# EAGLE schematic YAAB (EAGLE 6.4)
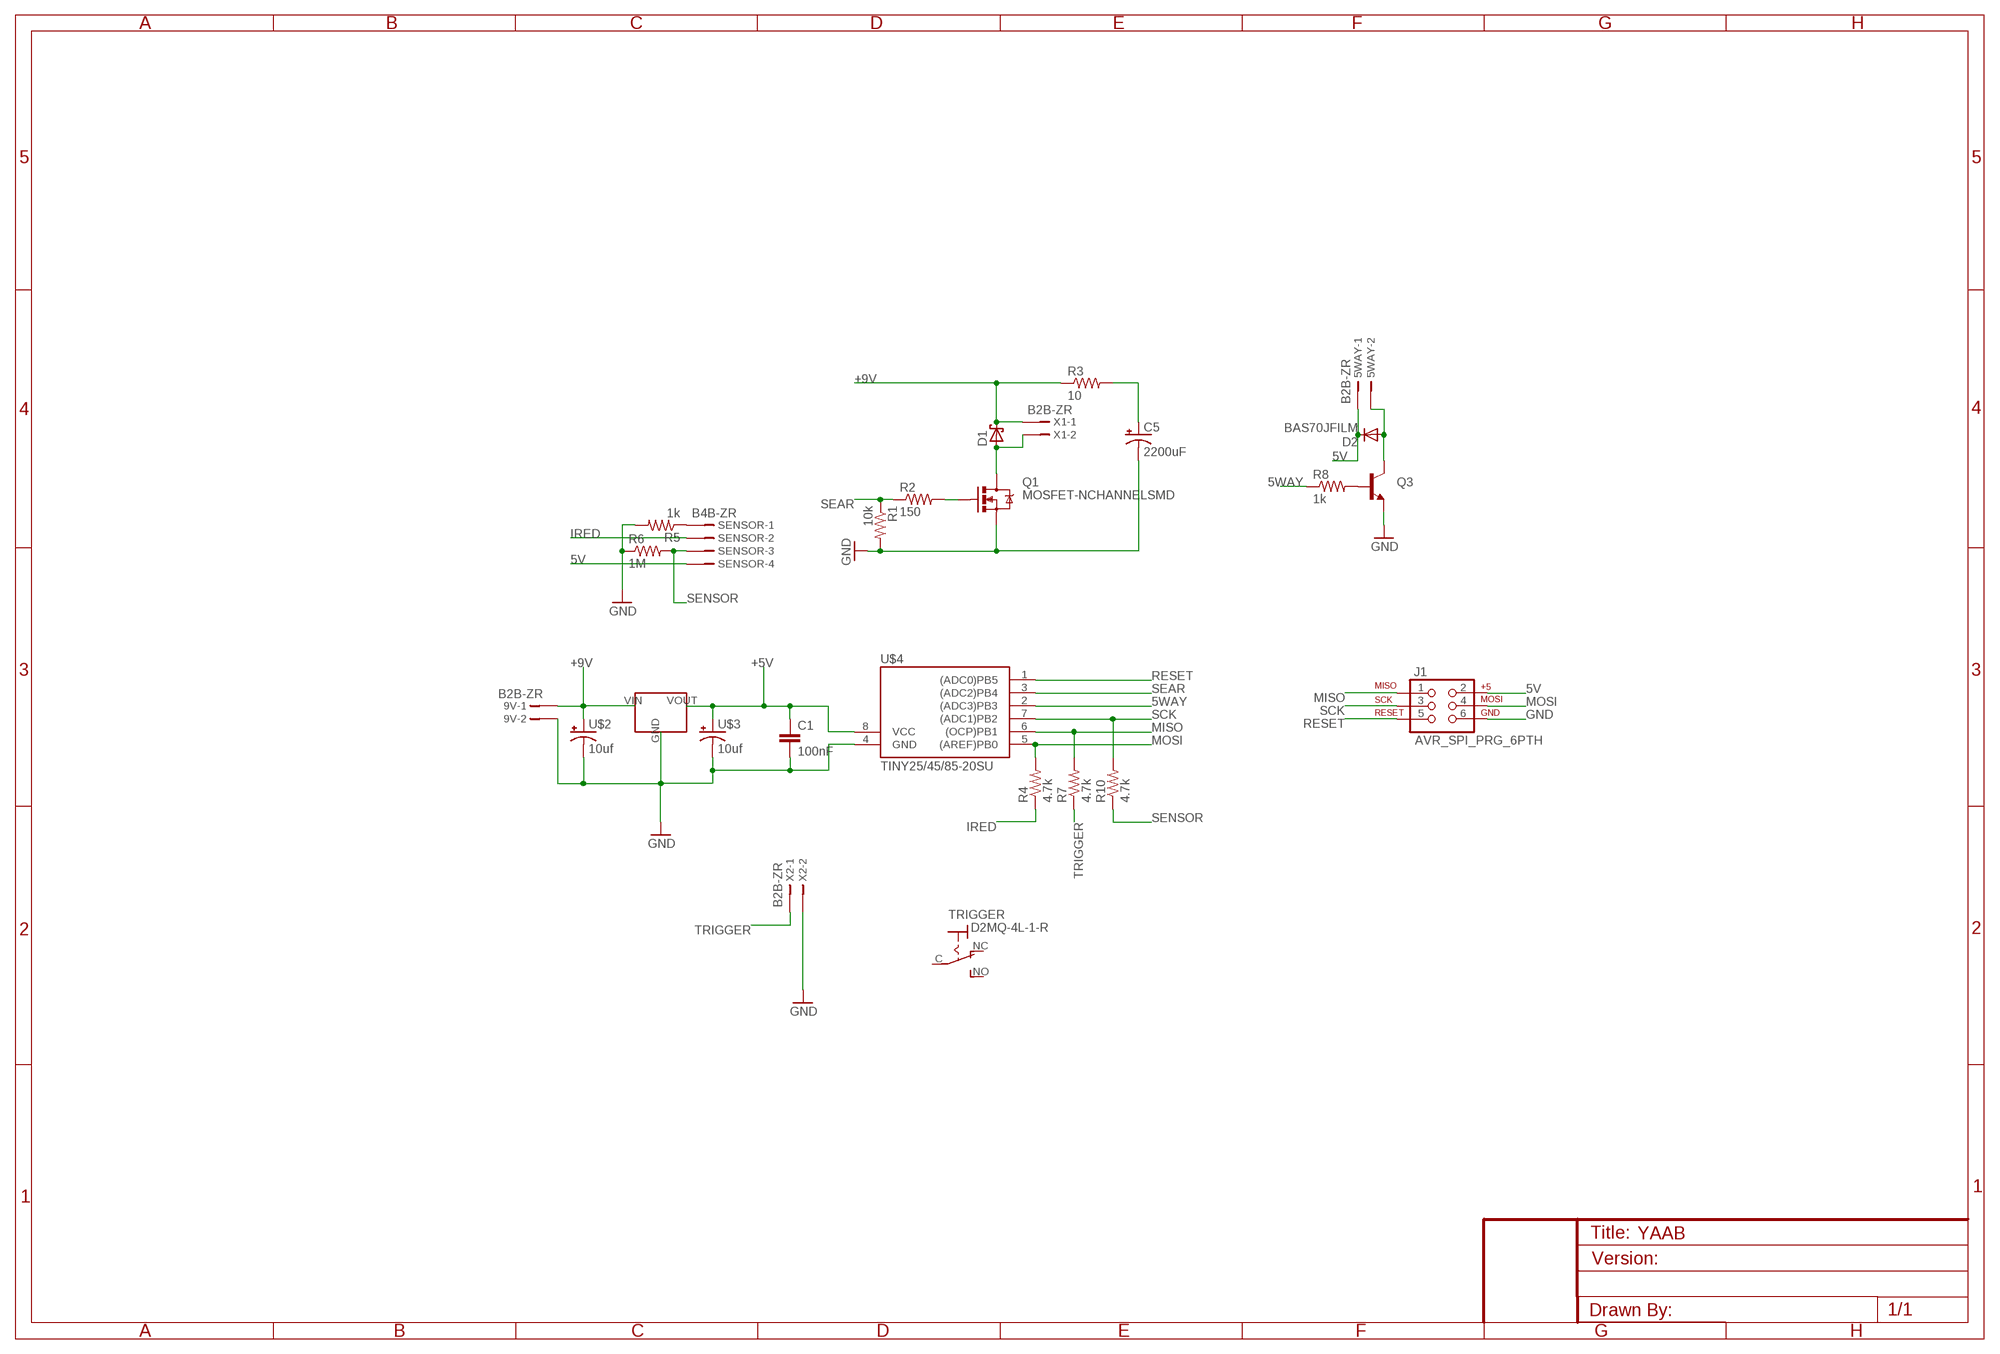
[diagram p0: schematic, sheet 1]

## Parts
5WAY  B2B-ZR  [B2B-ZR@1]
9V  B2B-ZR  [B2B-ZR@1]
C1  100nF  CAPKIT  [CAP-PTH-SMALL-KIT]
C5  2200uF  AVESMB  [AVES***M**B]
D1  SCHOTTKY-DIODESMC  [SMC]
D2  BAS70JFILM  DIODESOD  [SOD-323]
J1  AVR_SPI_PRG_6PTH  [2X3]
Q1  MOSFET-NCHANNELSMD  [SOT23-3]
Q3  TRANSISTOR_NPNSOT89  [SOT89]
R1  10k  RESISTOR0603-RES  [0603-RES]
R2  150  RESISTOR0603-RES  [0603-RES]
R3  10  RESISTOR0603-RES  [0603-RES]
R4  4.7k  RESISTOR1206  [1206]
R5  1k  R-US_R0603  [R0603]
R6  1M  R-US_R0603  [R0603]
R7  4.7k  RESISTOR1206  [1206]
R8  1k  R-US_R0603  [R0603]
R10  4.7k  RESISTOR1206  [1206]
SENSOR  B4B-ZR  [B4B-ZR]
TRIGGER  D2MQ-4L-1-R  [D2MQ-4L-1-R]
U$1  L78M05C  [SOT-89]
U$2  10uf  AVESMB  [AVES***M**B]
U$3  10uf  AVESMB  [AVES***M**B]
U$4  TINY25/45/85-20SU  [SOIC8]
X1  B2B-ZR  [B2B-ZR@1]
X2  B2B-ZR  [B2B-ZR]

## Nets
5V: 5WAY.1 D2.1(C) J1.2 SENSOR.4
5WAY: R8.1 U$4.2((ADC3)PB3)
+5V: C1.1 U$1.VOUT(OUT) U$3.P$1+(+) U$4.8(VCC)
+9V: 9V.1 D1.C R3.1 U$1.VIN(IN) U$2.P$1+(+) X1.1
GND: 9V.2 C1.2 C5.P$2-(-) J1.6 Q1.2(S) Q3.3(E) R1.2 R5.2 R6.1 U$1.GND U$2.P$2-(-) U$3.P$2-(-) U$4.4(GND)
IRED: R4.1 SENSOR.2
MISO: J1.1 R7.2 U$4.6((OCP)PB1)
MOSI: J1.4 R4.2 U$4.5((AREF)PB0)
N$2: Q1.1(G) R2.2
N$3: D1.A Q1.3(D) X1.2
N$4: C5.P$1+(+) R3.2
N$9: R5.1 SENSOR.1
N$15: 5WAY.2 D2.2(A) Q3.2(C)
N$17: Q3.1(B) R8.2
RESET: J1.5 U$4.1((ADC0)PB5)
SCK: J1.3 R10.2 U$4.7((ADC1)PB2)
SEAR: R1.1 R2.1 U$4.3((ADC2)PB4)
SENSOR: R6.2 R10.1 SENSOR.3
TRIGGER: R7.1 X2.1 X2.2
Unconnected: TRIGGER.C(P) TRIGGER.NC(O) TRIGGER.NO(S)

## Library data of the parts
5WAY 9V X1 = Parts:B2B-ZR: ZH CONNECTOR 1.5 mm, 2 pin 1 row Source: http://www.jst.com .. eZH.pdf
C1 = SparkFun:CAP: Capacitor Standard 0603 ceramic capacitor, and 0.1" leaded capacitor.
C5 U$2 U$3 = Parts:AVES***M**B
D1 = diode:SCHOTTKY-DIODE: Schottky Diode
D2 = SparkFun:DIODE: Diode These are standard reverse protection diodes and small signal diodes. SMA package can handle up to about 1A. SOD-323 can handle about 200mA. What the SOD-323 package when ordering, there are some mfgs out there that are 5-pin packages.
J1 = SparkFun:AVR_SPI_PRG_6: AVR ISP 6 Pin This is the reduced ISP connector for AVR programming. Common on Arduino. This footprint will take up less PCB space and can be used with a 10-pin to 6-pin adapter such as SKU: BOB-08508
Q1 = SparkFun:MOSFET-NCHANNEL
Q3 = SparkFun:TRANSISTOR_NPN: Transistor NPN BJT configuration in SOT23 package. MMBT2222 is the common NPN we use. Double check BCE configuration again layout.
R1-R4 R7 R10 = SparkFun:RESISTOR: Resistor Basic schematic elements and footprints for 0603, 1206, and PTH resistors.
R5 R6 R8 = resistor:R-US_: RESISTOR, American symbol
SENSOR = con-jst:?4B-ZR: ZH CONNECTOR 1.5 mm, 4 pin 1 row Source: http://www.jst.com .. eZH.pdf; MF: FARNELL; MPN: B4B-ZR(LF)(SN); OC_FARNELL: 1830916; OC_NEWARK: 37K9960
TRIGGER = Parts:D2MQ-4L-1-R: Snap-action Switch with Ultra Subminiature Size (6.5 x 8.2 x 2.7 mm)(HxWxD) Light Weight (0.3 g) Excellent electrical characteristics and a snap-action mechanism in spite of its ultra small size. Gold-plated (Au-P) contacts for micro load switching available in addition to silver-plated contacts (Ag-P). Ideal for applications where size is extremely limited and high reliability is demanded, such as in compact audio, optical, and telecommunications equipment.
U$1 = Parts:L78M05C
U$4 = avr-7:TINY25/45/85
X2 = Parts:?2B-ZR: ZH CONNECTOR 1.5 mm, 4 pin 1 row Source: http://www.jst.com .. eZH.pdf